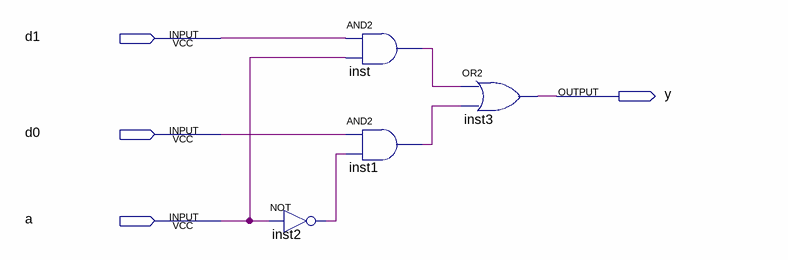
[diagram p0: schematic sheet]
// Quartus schematic mux21.bdf as structural Verilog: 4 symbols, 4 pins
module mux21 (
  input  d1,
  input  d0,
  input  a,
  output y
);

  wire inst1_out, inst2_out, inst_out;

  not inst2 (inst2_out, a);
  and inst (inst_out, d1, a);
  and inst1 (inst1_out, d0, inst2_out);
  or inst3 (y, inst_out, inst1_out);
endmodule
